# EAGLE board G_FY2015_Mez (EAGLE 6.5.0), part 1 of 2
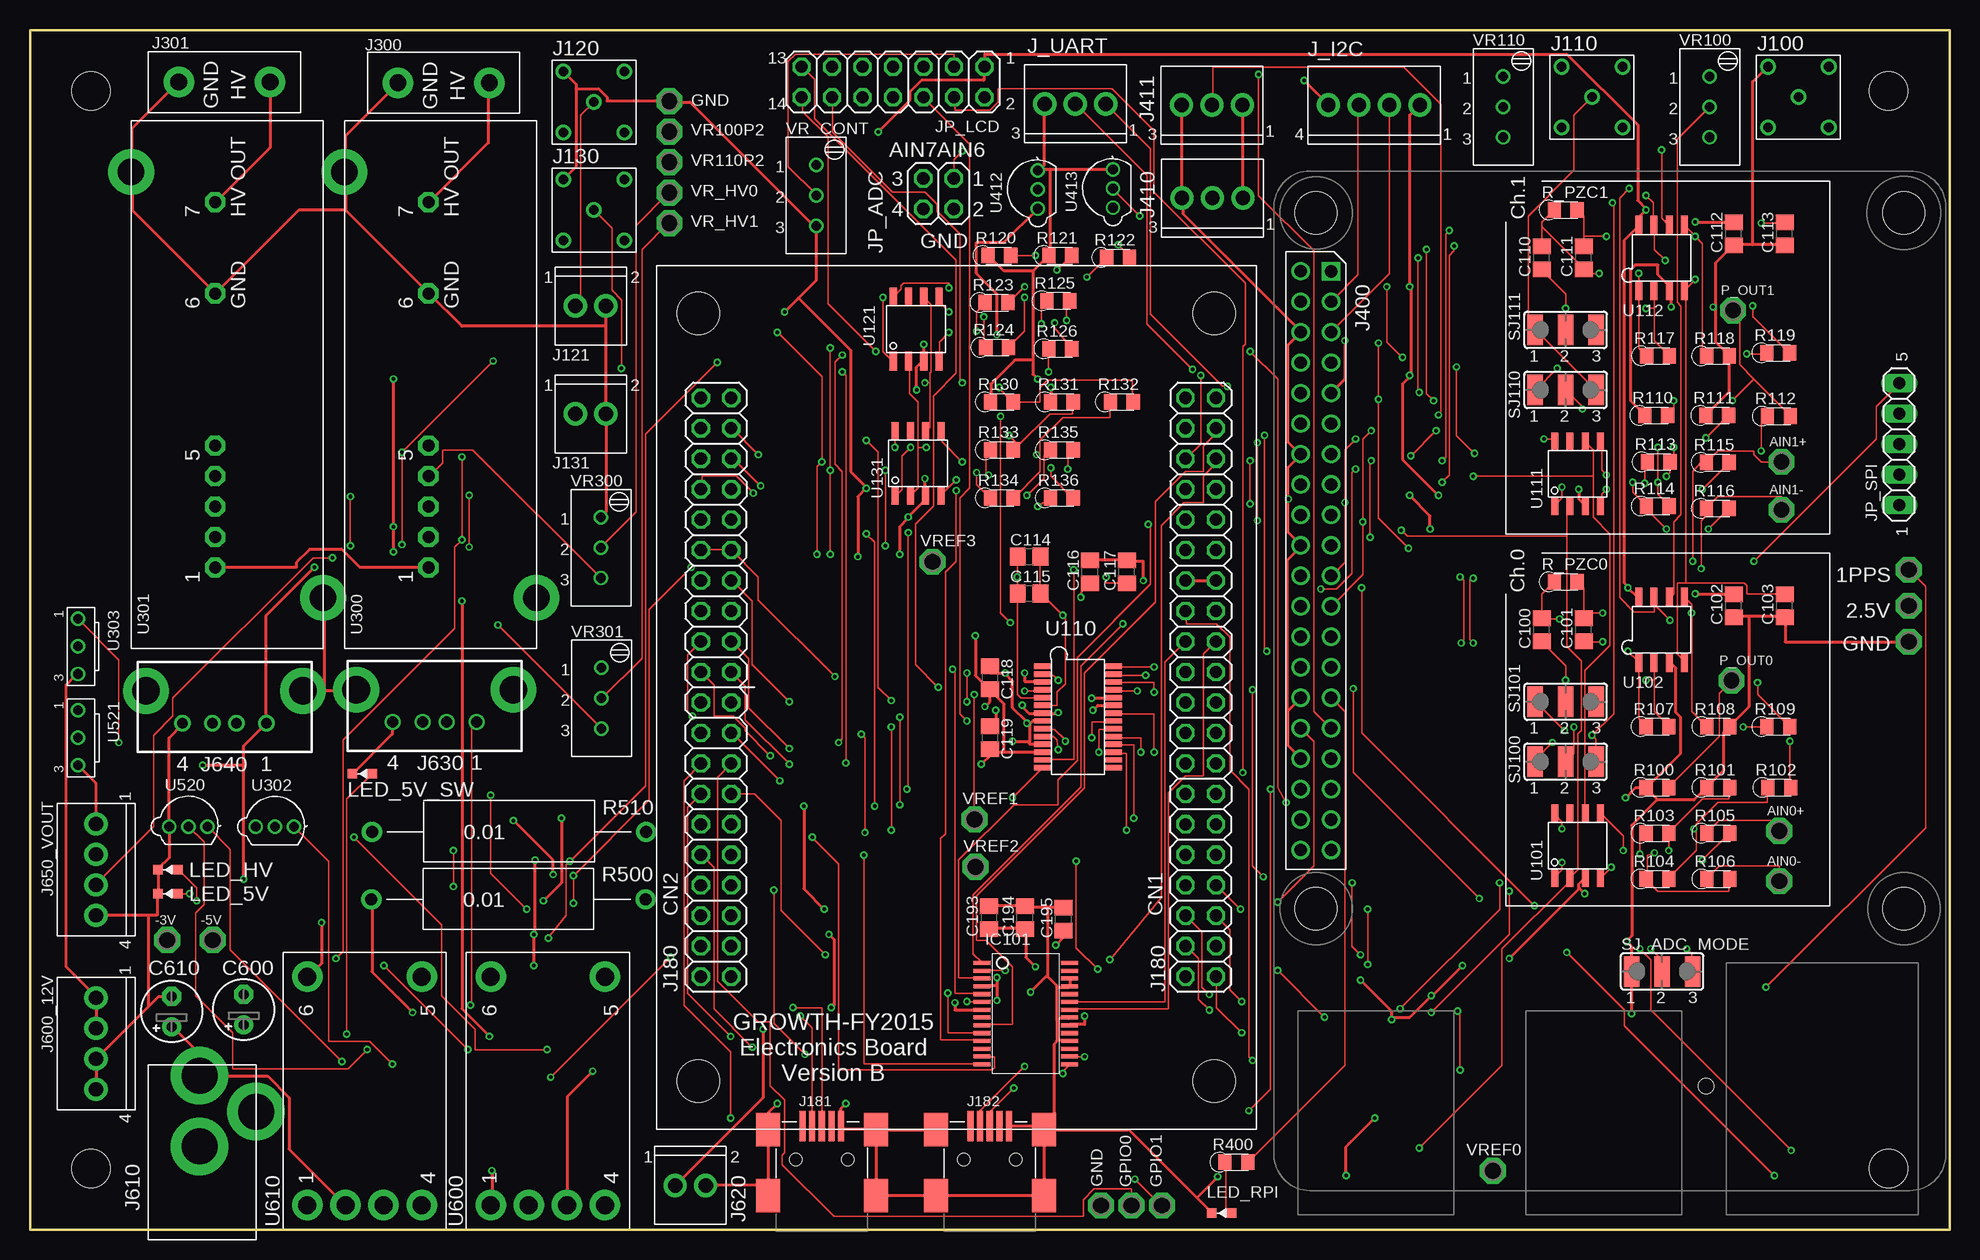
[diagram p5: board, top side]
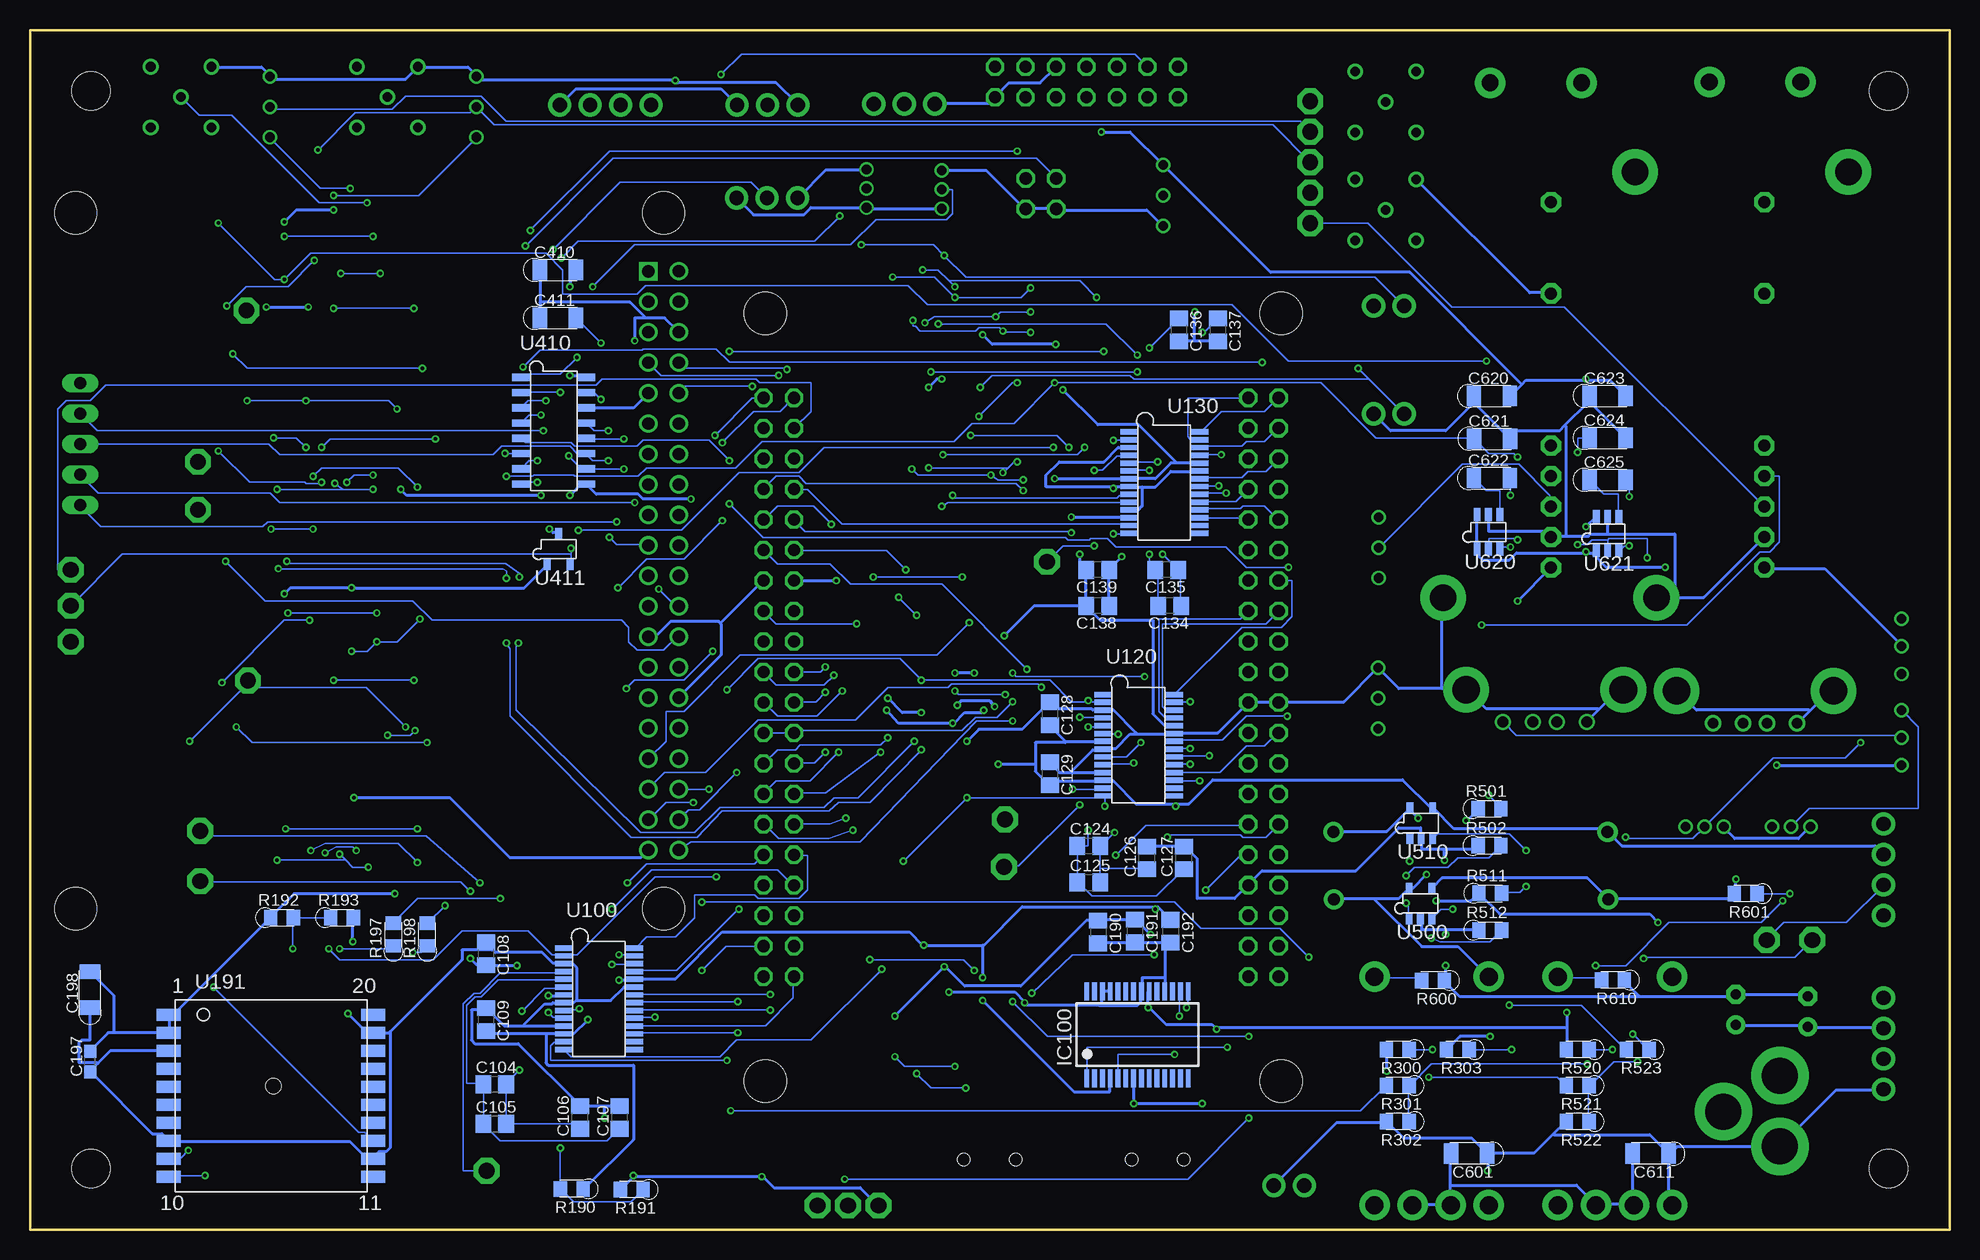
[diagram p6: board, bottom side, seen from below]

Size 160 x 100 mm. Coordinates in mm from the lower left corner, seen from the top.
Outline: 0,0 160,0 160,100 0,100 0,0
Copper layers (1+2*15+16): Top 0.018mm / dielectric 0.25mm / Route2 0.035mm / dielectric 1mm / Route15 0.035mm / dielectric 0.25mm / Bottom 0.018mm
Design rules "pban_5mil-l4": minimum track width 5mil, minimum drill 0.3mm, track to track 5mil, track to pad 0.229mm, pad to pad 5mil, via to via 5mil, smd to smd 5mil, copper to edge 0.5mm, drill to drill 0.5mm, minimum pad ring 0.15mm, minimum via ring 0.15mm, stop-mask expansion 4mil, vias tented up to drill 0.35mm, thermal gap 10mil
Net classes: 1 power: width 0.254 mm, clearance 0.178 mm
Holes 3.2 mm at 5.08,5.08 5.08,94.92 154.92,5.08 154.92,94.92
tRestrict: area 2,2 to 8,8; area 2,92 to 8,98; area 152,92 to 158,98; area 152,2 to 158,8
bRestrict: area 2,2 to 8,8; area 2,92 to 8,98; area 152,92 to 158,98; area 152,2 to 158,8

## Footprints (pad centres in the part's own frame; a part is rotated, then mirrored left to right if it is on the bottom)
P1-13 = drill 1.321 pad 2.159 octagon: TP 0,0
C0805 = smd 1.3 x 1.5: 1 -0.95,0; 2 0.95,0
C0603 = smd 1.1 x 1: 1 -0.85,0; 2 0.85,0
3216 = smd 1.2 x 1.7: 1 -1.5,0; 2 1.5,0
E2,5-5 = drill 0.813 pad 1.6: + -1.27,0 | drill 0.813 pad 1.6 octagon: - 1.27,0
SSOP28 = smd 0.4 x 1.5: 1 -4.225,-3.625; 2 -3.575,-3.625; 3 -2.925,-3.625; 4 -2.275,-3.625; 5 -1.625,-3.625; 6 -0.975,-3.625; 7 -0.325,-3.625; 8 0.325,-3.625; 9 0.975,-3.625; 10 1.625,-3.625; 11 2.275,-3.625; 12 2.925,-3.625; 13 3.575,-3.625; 14 4.225,-3.625; 15 4.225,3.625; 16 3.575,3.625; 17 2.925,3.625; 18 2.275,3.625; 19 1.625,3.625; 20 0.975,3.625; 21 0.325,3.625; 22 -0.325,3.625; 23 -0.975,3.625; 24 -1.625,3.625; 25 -2.275,3.625; 26 -2.925,3.625; 27 -3.575,3.625; 28 -4.225,3.625
SSOP28DB = smd 0.348 x 1.397: 1 -4.225,-3.656; 2 -3.575,-3.656; 3 -2.925,-3.656; 4 -2.275,-3.656; 5 -1.625,-3.656; 6 -0.975,-3.656; 7 -0.325,-3.656; 8 0.325,-3.656; 9 0.975,-3.656; 10 1.625,-3.656; 11 2.275,-3.656; 12 2.925,-3.656; 13 3.575,-3.656; 14 4.225,-3.656; 15 4.225,3.656; 16 3.575,3.656; 17 2.925,3.656; 18 2.275,3.656; 19 1.625,3.656; 20 0.975,3.656; 21 0.325,3.656; 22 -0.325,3.656; 23 -0.975,3.656; 24 -1.625,3.656; 25 -2.275,3.656; 26 -2.925,3.656; 27 -3.575,3.656; 28 -4.225,3.656
EPL.00.250.NTN = drill 0.8 pad 1.3: 1 0,0; S1 -2.54,2.54; S2 -2.54,-2.54; S3 2.54,-2.54; S4 2.54,2.54
IL-2P-S3EN2 = drill 1.2 pad 1.93: P$1 -2.54,0; P$2 0,0
TOKUDEN_SP6 = drill 1.016 octagon: 1 12.71,-46.65; 2 12.71,-44.11; 3 15.25,-46.65; 4 15.25,-44.11; 5 17.79,-46.65; 6 17.79,-44.11; 7 20.33,-46.65; 8 20.33,-44.11; 9 22.87,-46.65; 10 22.87,-44.11; 11 25.41,-46.65; 12 25.41,-44.11; 13 27.95,-46.65; 14 27.95,-44.11; 15 30.49,-46.65; 16 30.49,-44.11; 17 33.03,-46.65; 18 33.03,-44.11; 19 35.57,-46.65; 20 35.57,-44.11; 21 38.11,-46.65; 22 38.11,-44.11; 23 40.65,-46.65; 24 40.65,-44.11; 25 43.19,-46.65; 26 43.19,-44.11; 27 45.73,-46.65; 28 45.73,-44.11; 29 48.27,-46.65; 30 48.27,-44.11; 31 50.81,-46.65; 32 50.81,-44.11; 33 53.35,-46.65; 34 53.35,-44.11; 35 55.89,-46.65; 36 55.89,-44.11; 37 58.43,-46.65; 38 58.43,-44.11; 39 60.97,-46.65; 40 60.97,-44.11; 41 12.71,-6.24; 42 12.71,-3.7; 43 15.25,-6.24; 44 15.25,-3.7; 45 17.79,-6.24; 46 17.79,-3.7; 47 20.33,-6.24; 48 20.33,-3.7; 49 22.87,-6.24; 50 22.87,-3.7; 51 25.41,-6.24; 52 25.41,-3.7; 53 27.95,-6.24; 54 27.95,-3.7; 55 30.49,-6.24; 56 30.49,-3.7; 57 33.03,-6.24; 58 33.03,-3.7; 59 35.57,-6.24; 60 35.57,-3.7; 61 38.11,-6.24; 62 38.11,-3.7; 63 40.65,-6.24; 64 40.65,-3.7; 65 43.19,-6.24; 66 43.19,-3.7; 67 45.73,-6.24; 68 45.73,-3.7; 69 48.27,-6.24; 70 48.27,-3.7; 71 50.81,-6.24; 72 50.81,-3.7; 73 53.35,-6.24; 74 53.35,-3.7; 75 55.89,-6.24; 76 55.89,-3.7; 77 58.43,-6.24; 78 58.43,-3.7; 79 60.97,-6.24; 80 60.97,-3.7 | hole 3.5: 4,-3.5; 4,-46.5; 68,-46.5; 68,-3.5
MINIUSB5+4P-SMD-0.8-90D = smd 2.54 x 0.508: 1 0.381,-1.6; 2 0.381,-0.8; 3 0.381,0; 4 0.381,0.8; 5 0.381,1.6 | smd 2.794 x 2: P$1 6.175,4.5; P$2 6.175,-4.5; P$3 0.675,4.5; P$4 0.675,-4.5 | hole 1.016: 3.175,-2.159; 3.175,2.159
SHV_PIGTAIL_LAND = drill 1.4 pad 2.54: P$1 0,3.81; P$2 0,-3.81
RPI2_GPIO_HOLES = drill 1.016 square: P$1 -33.54,23.29 | drill 1.016: P$2 -33.553,25.832; P$3 -31.013,23.292; P$4 -31.013,25.832; P$5 -28.473,23.292; P$6 -28.473,25.832; P$7 -25.933,23.292; P$8 -25.933,25.832; P$9 -23.393,23.292; P$10 -23.393,25.832; P$11 -20.853,23.292; P$12 -20.853,25.832; P$13 -18.313,23.292; P$14 -18.313,25.832; P$15 -15.773,23.292; P$16 -15.773,25.832; P$17 -13.233,23.292; P$18 -13.233,25.832; P$19 -10.693,23.292; P$20 -10.693,25.832; P$21 -8.153,23.292; P$22 -8.153,25.832; P$23 -5.613,23.292; P$24 -5.613,25.832; P$25 -3.073,23.292; P$26 -3.073,25.832; P$27 -0.533,23.292; P$28 -0.533,25.832; P$29 2.007,23.292; P$30 2.007,25.832; P$31 4.547,23.292; P$32 4.547,25.832; P$33 7.087,23.292; P$34 7.087,25.832; P$35 9.627,23.292; P$36 9.627,25.832; P$37 12.167,23.292; P$38 12.167,25.832; P$39 14.707,23.292; P$40 14.707,25.832 | hole 3.5: -38.41,-24.44; 19.59,-24.44; -38.41,24.56; 19.59,24.56
IL-3P-S3EN2 = drill 1.2 pad 1.93: P$1 -2.54,0; P$2 0,0; P$3 2.54,0
IL-4P-S3EN2 = drill 1.2 pad 1.93: P$1 -3.81,0; P$2 -1.27,0; P$3 1.27,0; P$4 3.81,0
PJ-102A = drill 3 pad 4.8: RING 0.1,-3.39; RING_SW -4.6,-6.29; TIP 0.1,-9.29
LUMBERG_2410-01 = drill 0.9: D+ -1,0; D- 1,0; GND -3.5,0; VBUS 3.5,0 | drill 2.3 pad 3.81: GND1 -6.55,2.7; GND2 6.55,2.7
2X02 = drill 1.016 octagon: 1 -1.27,-1.27; 2 -1.27,1.27; 3 1.27,-1.27; 4 1.27,1.27
LCD16X2 = drill 1.016 octagon: 1 -7.62,-1.27; 2 -7.62,1.27; 3 -5.08,-1.27; 4 -5.08,1.27; 5 -2.54,-1.27; 6 -2.54,1.27; 7 0,-1.27; 8 0,1.27; 9 2.54,-1.27; 10 2.54,1.27; 11 5.08,-1.27; 12 5.08,1.27; 13 7.62,-1.27; 14 7.62,1.27
1X05 = drill 1.016 long: 1 -5.08,0; 2 -2.54,0; 3 0,0; 4 2.54,0; 5 5.08,0
LED_1608 = smd 0.8 x 0.8: P$1 0,0.825; P$2 0,-0.825
2012 = smd 1.1 x 1.3: 1 -0.95,0; 2 0.95,0
R_LVR03 = drill 1 pad 1.676: P$1 -11.43,0; P$2 11.43,0
SJ_2W = smd 1.27 x 2.54: 1 -2.54,0; 2 0,0; 3 2.54,0
TSSOP-28(4.4MM)(0.65MM)_LONGPAD = smd 0.45 x 1.4: 1 -4.225,-2.975; 2 -3.575,-2.975; 3 -2.925,-2.975; 4 -2.275,-2.975; 5 -1.625,-2.975; 6 -0.975,-2.975; 7 -0.325,-2.975; 8 0.325,-2.975; 9 0.975,-2.975; 10 1.625,-2.975; 11 2.275,-2.975; 12 2.925,-2.975; 13 3.575,-2.975; 14 4.225,-2.975; 15 4.225,2.975; 16 3.575,2.975; 17 2.925,2.975; 18 2.275,2.975; 19 1.625,2.975; 20 0.975,2.975; 21 0.325,2.975; 22 -0.325,2.975; 23 -0.975,2.975; 24 -1.625,2.975; 25 -2.275,2.975; 26 -2.925,2.975; 27 -3.575,2.975; 28 -4.225,2.975
SOIC-8(150MIL)(1.27MM) = smd 0.6 x 1.55: 1 -1.905,-2.67; 2 -0.635,-2.67; 3 0.635,-2.67; 4 1.905,-2.67; 5 1.905,2.67; 6 0.635,2.67; 7 -0.635,2.67; 8 -1.905,2.67
SOP8 = smd 0.6 x 1.62: 1 -1.905,-2.694; 2 -0.635,-2.694; 3 0.635,-2.694; 4 1.905,-2.694; 5 1.905,2.694; 6 0.635,2.694; 7 -0.635,2.694; 8 -1.905,2.694
GPS_FGPMMOPA6H = smd 2 x 1: P$1 -8.508,6.75; P$2 -8.508,5.25; P$3 -8.508,3.75; P$4 -8.508,2.25; P$5 -8.508,0.75; P$6 -8.508,-0.75; P$7 -8.508,-2.25; P$8 -8.508,-3.75; P$9 -8.508,-5.25; P$10 -8.508,-6.75; P$11 8.508,-6.75; P$12 8.508,-5.25; P$13 8.508,-3.75; P$14 8.508,-2.25; P$15 8.508,-0.75; P$16 8.508,0.75; P$17 8.508,2.25; P$18 8.508,3.75; P$19 8.508,5.25; P$20 8.508,6.75 | hole 1.3: 0.2,0.8
OPTON_PA = drill 1 pad 1.676 octagon: P$1 -15.24,0; P$2 -12.7,0; P$3 -10.16,0; P$4 -7.62,0; P$5 -5.08,0; P$6 7.62,0; P$7 15.24,0 | drill 2.2 pad 3.81: P$8 17.75,7; P$9 -17.75,-9
TO-92-R2.5C = drill 0.8: 1 -1.6,0; 2 0,0; 3 1.6,0
2-7J2B = drill 0.8: P$1 -2.3,0; P$2 0,0; P$3 2.3,0
SOIC-16(150MIL)(1.27MM) = smd 0.6 x 1.55: 1 -4.445,-2.68; 2 -3.175,-2.68; 3 -1.905,-2.68; 4 -0.635,-2.68; 5 0.635,-2.68; 6 1.905,-2.68; 7 3.175,-2.68; 8 4.445,-2.68; 9 4.445,2.66; 10 3.175,2.66; 11 1.905,2.66; 12 0.635,2.66; 13 -0.635,2.66; 14 -1.905,2.66; 15 -3.175,2.66; 16 -4.445,2.66
TSOT-23-3 = smd 0.57 x 0.95: 1 -0.95,-1.25; 2 0.95,-1.25; 3 0,1.29
TSOT-5 = smd 0.57 x 0.95: 1 -0.95,-1.25; 2 0,-1.25; 3 0.95,-1.25; 4 0.95,1.25; 5 -0.95,1.25
PHT12050 = drill 1.5 pad 2.54: P$1 2.032,-2.032; P$2 2.032,-5.207; P$3 2.032,-8.382; P$4 2.032,-11.557; P$5 21.082,-11.557; P$6 21.082,-2.032
SOT-23 = smd 0.57 x 1.1: 1 -0.95,-1.4; 2 0,-1.4; 3 0.95,-1.4; 4 0.95,1.45; 5 0,1.45; 6 -0.95,1.45
ADJRP3-9.70XW5.0X9.80MM = drill 0.8: 1 0,2.54; 2 0,0; 3 0,-2.54

## Placement (x,y rotation side)
1PPS  TPPAD1-13  [P1-13]  156.6,55 180 top
2.5V  TPPAD1-13  [P1-13]  156.6,52 180 top
-3V  TPPAD1-13  [P1-13]  11.43,24.13 0 top
-5V  TPPAD1-13  [P1-13]  15.24,24.13 0 top
AIN0+  TPPAD1-13  [P1-13]  145.81,33.23 0 top
AIN0-  TPPAD1-13  [P1-13]  145.81,29.04 0 top
AIN1+  TPPAD1-13  [P1-13]  146,64 0 top
AIN1-  TPPAD1-13  [P1-13]  146,60 0 top
C100  100p  [C0805]  126,50 90 top
C101  200p  [C0805]  129.5,50 90 top
C102  0.033u  [C0805]  142,52 90 top
C103  0.033u  [C0805]  146.25,52 90 top
C104  0.1u  [C0805]  121.26,12.12 0 bottom
C105  10u  [C0805]  121.26,8.81 0 bottom
C106  0.1u  [C0805]  114.15,9.35 90 bottom
C107  0.1u  [C0805]  110.84,9.35 90 bottom
C108  0.1u  [C0805]  122,23 270 bottom
C109  10u  [C0805]  122,17.5 270 bottom
C110  100p  [C0805]  126,81 90 top
C111  200p  [C0805]  129.5,81 90 top
C112  0.033u  [C0805]  142,83 90 top
C113  0.033u  [C0805]  146.25,83 90 top
C114  0.1u  [C0805]  83.28,56.1 0 top
C115  10u  [C0805]  83.28,53.04 0 top
C116  0.1u  [C0805]  88.36,54.83 90 top
C117  0.1u  [C0805]  91.42,54.83 90 top
C118  0.1u  [C0805]  80,46 270 top
C119  10u  [C0805]  80,41 270 top
C124  0.1u  [C0805]  71.75,32 0 bottom
C125  10u  [C0805]  71.75,28.94 0 bottom
C126  0.1u  [C0805]  66.89,30.98 90 bottom
C127  0.1u  [C0805]  63.83,30.98 90 bottom
C128  0.1u  [C0805]  75,43 270 bottom
C129  10u  [C0805]  75,38 270 bottom
C134  0.1u  [C0805]  65,52 180 bottom
C135  10u  [C0805]  65.25,55 180 bottom
C136  0.1u  [C0805]  64.25,75 270 bottom
C137  0.1u  [C0805]  61,75 270 bottom
C138  0.1u  [C0805]  71,52 180 bottom
C139  10u  [C0805]  71,55 180 bottom
C190  0.1u  [C0805]  70.96,24.8 270 bottom
C191  4.7u  [C0805]  67.92,24.88 270 bottom
C192  0.1u  [C0805]  64.93,24.86 270 bottom
C193  0.1u  [C0805]  79.95,26 90 top
C194  4.7u  [C0805]  82.94,26 90 top
C195  0.1u  [C0805]  86.15,25.88 90 top
C197  0.01u  [C0603]  155,14 90 bottom
C198  10u  [3216]  155,20 90 bottom
C410  1u  [3216]  116,80 0 bottom
C411  10u  [3216]  116,76 0 bottom
C600  100u  [E2,5-5]  17.81,18.33 90 top
C601  10u  [3216]  40.04,6.32 180 bottom
C610  100u  [E2,5-5]  11.81,18.18 90 top
C611  10u  [3216]  24.93,6.32 180 bottom
C620  10u  [3216]  38.15,69.49 0 bottom
C621  10u  [3216]  38.11,65.93 0 bottom
C622  1u  [3216]  38.15,62.65 0 bottom
C623  10u  [3216]  28.5,69.5 0 bottom
C624  10u  [3216]  28.5,66 0 bottom
C625  1u  [3216]  28.5,62.5 0 bottom
GND  TPPAD1-13  [P1-13]  156.6,49 180 top
GPIO0  TPPAD1-13  [P1-13]  91.81,2 90 top
GPIO1  TPPAD1-13  [P1-13]  94.35,2 90 top
IC100  FT232RL  [SSOP28]  67.69,16.24 0 bottom
IC101  FT245RL  [SSOP28DB]  83,18 270 top
J100  EPL.00.250.NTN  [EPL.00.250.NTN]  147.4,94.4 0 top
J110  EPL.00.250.NTN  [EPL.00.250.NTN]  130.2,94.4 0 top
J120  EPL.00.250.NTN  [EPL.00.250.NTN]  47,94 0 top
J121  IL-2P-S3EN2  [IL-2P-S3EN2]  48,77 0 top
J130  EPL.00.250.NTN  [EPL.00.250.NTN]  47,85 0 top
J131  IL-2P-S3EN2  [IL-2P-S3EN2]  48,68 0 top
J180  TOKUDEN_SP6  [TOKUDEN_SP6]  52.21,8.37 90 top
J181  USB Mini-B Connector  [MINIUSB5+4P-SMD-0.8-90D]  66,9 270 top
J182  USB Mini-B Connector  [MINIUSB5+4P-SMD-0.8-90D]  80,9 270 top
J300  SHV_PIGTAIL_LAND  [SHV_PIGTAIL_LAND]  34.48,95.6 270 top
J301  SHV_PIGTAIL_LAND  [SHV_PIGTAIL_LAND]  16.21,95.66 270 top
J400  RPI2_GPIO_HOLES  [RPI2_GPIO_HOLES]  131.75,46.34 270 bottom
J410  IL-3P-S3EN2  [IL-3P-S3EN2]  98.56,86 180 top
J411  IL-3P-S3EN2  [IL-3P-S3EN2]  98.52,93.75 180 top
J600_12V  IL-4P-S3EN2  [IL-4P-S3EN2]  5.5,15.5 270 top
J610  2.1MMJACKTHM  [PJ-102A]  14.24,3.54 180 top
J620  IL-2P-S3EN2  [IL-2P-S3EN2]  56.32,3.67 0 top
J630  USB_TYPEA_LUMBERG_2410_01  [LUMBERG_2410-01]  33.74,42.31 0 top
J640  USB_TYPEA_LUMBERG_2410_01  [LUMBERG_2410-01]  16.21,42.2 0 top
J650_VOUT  IL-4P-S3EN2  [IL-4P-S3EN2]  5.5,30 270 top
J_I2C  IL-4P-S3EN2  [IL-4P-S3EN2]  112.04,93.75 180 top
J_UART  IL-3P-S3EN2  [IL-3P-S3EN2]  87.13,93.83 180 top
JP_ADC  [2X02]  75.73,86.35 180 top
JP_LCD  LCD16X2  [LCD16X2]  71.94,95.66 180 top
JP_SPI  [1X05]  155.81,65.47 90 top
LED_5V  SML-311WTT86  [LED_1608]  11.5,28 270 top
LED_5V_SW  SML-311WTT86  [LED_1608]  27.7,38 270 top
LED_HV  SML-311WTT86  [LED_1608]  11.5,30 270 top
LED_RPI  SML-311WTT86  [LED_1608]  99.34,1.36 270 top
P_OUT0  TPPAD1-13  [P1-13]  141.83,45.76 0 top
P_OUT1  TPPAD1-13  [P1-13]  141.96,76.62 0 top
R100  51  [2012]  135.65,36.85 0 top
R101  510  [2012]  140.73,36.85 0 top
R102  510  [2012]  145.81,36.85 0 top
R103  510  [2012]  135.65,33.04 0 top
R104  510  [2012]  135.65,29.23 0 top
R105  51  [2012]  140.73,33.04 0 top
R106  51  [2012]  140.73,29.23 0 top
R107  100k  [2012]  135.65,41.93 0 top
R108  10k  [2012]  140.73,41.93 0 top
R109  51  [2012]  145.73,41.93 0 top
R110  51  [2012]  135.55,67.87 0 top
R111  510  [2012]  140.63,67.87 0 top
R112  510  [2012]  145.77,67.81 0 top
R113  510  [2012]  135.75,64 0 top
R114  510  [2012]  135.67,60.31 0 top
R115  51  [2012]  140.67,63.95 0 top
R116  51  [2012]  140.67,60.12 0 top
R117  100k  [2012]  135.7,72.84 0 top
R118  10k  [2012]  140.7,72.83 0 top
R119  51  [2012]  145.72,73.09 0 top
R120  51  [2012]  80.8,81.2 0 top
R121  510  [2012]  85.88,81.2 0 top
R122  510  [2012]  90.7,81.04 0 top
R123  510  [2012]  80.56,77.28 0 top
R124  510  [2012]  80.62,73.54 0 top
R125  51  [2012]  85.71,77.43 0 top
R126  51  [2012]  85.88,73.43 0 top
R130  51  [2012]  81,69 0 top
R131  510  [2012]  86,69 0 top
R132  510  [2012]  91,69 0 top
R133  510  [2012]  81,65 0 top
R134  510  [2012]  81,61 0 top
R135  51  [2012]  86,65 0 top
R136  51  [2012]  86,61 0 top
R190  3k  [2012]  114.84,3.39 180 bottom
R191  1k  [2012]  109.84,3.33 180 bottom
R192  2k  [2012]  139,26 0 bottom
R193  1k  [2012]  134,26 0 bottom
R197  330  [2012]  129.7,24.59 90 bottom
R198  330  [2012]  126.89,24.59 90 bottom
R300  47k  [2012]  46,15 180 bottom
R301  4.7k  [2012]  46,12 180 bottom
R302  4.7k  [2012]  46,9 180 bottom
R303  4.7k  [2012]  41,15 180 bottom
R400  680  [2012]  100.56,5.62 0 top
R500  0.01  [R_LVR03]  39.88,27.51 0 top
R501  100  [2012]  38.35,35.08 0 bottom
R502  10k  [2012]  38.35,32.01 0 bottom
R510  0.01  [R_LVR03]  39.93,33.15 0 top
R511  100  [2012]  38.29,28.03 0 bottom
R512  10k  [2012]  38.29,24.96 0 bottom
R520  47k  [2012]  31,15 180 bottom
R521  4.7k  [2012]  31,12 180 bottom
R522  4.7k  [2012]  31,9 180 bottom
R523  1.5k  [2012]  26,15 180 bottom
R600  270  [2012]  43.05,20.76 180 bottom
R601  1.5k  [2012]  17,28 180 bottom
R610  2k  [2012]  28.05,20.79 180 bottom
R_PZC0  56k  [2012]  128,54 0 top
R_PZC1  56k  [2012]  128,85 0 top
SJ100  [SJ_2W]  128,39 0 top
SJ101  [SJ_2W]  128,44 0 top
SJ110  [SJ_2W]  128,70 0 top
SJ111  [SJ_2W]  128,75 0 top
SJ_ADC_MODE  [SJ_2W]  136.04,21.52 0 top
TP_GND  TPPAD1-13  [P1-13]  53.29,94.06 0 top
TP_GND2  TPPAD1-13  [P1-13]  89.27,2 90 top
U100  AD9215LONG_PAD  [TSSOP-28(4.4MM)(0.65MM)_LONGPAD]  112.57,19.24 270 bottom
U101  AD8138  [SOIC-8(150MIL)(1.27MM)]  129,32 0 top
U102  LM6172  [SOP8]  136,50 0 top
U110  AD9215LONG_PAD  [TSSOP-28(4.4MM)(0.65MM)_LONGPAD]  87.36,42.72 270 top
U111  AD8138  [SOIC-8(150MIL)(1.27MM)]  129,63 0 top
U112  LM6172  [SOP8]  136,81 0 top
U120  AD9215LONG_PAD  [TSSOP-28(4.4MM)(0.65MM)_LONGPAD]  67.58,40.37 270 bottom
U121  AD8138  [SOIC-8(150MIL)(1.27MM)]  73.86,75.07 0 top
U130  AD9215LONG_PAD  [TSSOP-28(4.4MM)(0.65MM)_LONGPAD]  65.45,62.26 270 bottom
U131  AD8138  [SOIC-8(150MIL)(1.27MM)]  74.02,63.87 0 top
U191  GPS_FGPMMOPA6H  [GPS_FGPMMOPA6H]  139.91,11.16 0 bottom
U300  OPTON_1PA_12  [OPTON_PA]  33.21,70.42 90 top
U301  OPTON_1PA_12  [OPTON_PA]  15.43,70.42 90 top
U302  2SC1815  [TO-92-R2.5C]  20.41,33.57 0 top
U303  2SJ681  [2-7J2B]  4,48.62 270 top
U410  MCP3208-CI/SL  [SOIC-16(150MIL)(1.27MM)]  116.34,66.6 270 bottom
U411  MCP1525TSOT-23-3  [TSOT-23-3]  115.94,56.72 0 bottom
U412  LM60  [TO-92-R2.5C]  84.01,86.7 90 top
U413  LM60  [TO-92-R2.5C]  90.27,86.79 90 top
U500  LT6106  [TSOT-5]  44.1,27.18 0 bottom
U510  LT6106  [TSOT-5]  44.04,33.88 0 bottom
U520  2SC1815  [TO-92-R2.5C]  13.2,33.6 0 top
U521  2SJ681  [2-7J2B]  4,41 270 top
U600  PHT12050WAH  [PHT12050]  36.37,0 90 top
U610  PHT12050WAH  [PHT12050]  21.09,0 90 top
U620  LTC1983ES6-3  [SOT-23]  38.43,58.15 0 bottom
U621  LTC1983ES6-5  [SOT-23]  28.5,58 0 bottom
VR100  5k  [ADJRP3-9.70XW5.0X9.80MM]  140,93.6 0 top
VR100P2  TPPAD1-13  [P1-13]  53.29,91.52 0 top
VR110  5k  [ADJRP3-9.70XW5.0X9.80MM]  122.8,93.6 0 top
VR110P2  TPPAD1-13  [P1-13]  53.29,88.98 0 top
VR300  5k  [ADJRP3-9.70XW5.0X9.80MM]  47.59,56.85 0 top
VR301  5k  [ADJRP3-9.70XW5.0X9.80MM]  47.64,44.28 0 top
VR_CONT  5k  [ADJRP3-9.70XW5.0X9.80MM]  65.54,86.22 0 top
VR_HV0  TPPAD1-13  [P1-13]  53.29,86.44 0 top
VR_HV1  TPPAD1-13  [P1-13]  53.29,83.9 0 top
VREF0  TPPAD1-13  [P1-13]  121.93,4.9 0 top
VREF1  TPPAD1-13  [P1-13]  78.74,34.18 0 top
VREF2  TPPAD1-13  [P1-13]  78.81,30.22 0 top
VREF3  TPPAD1-13  [P1-13]  75.22,55.67 0 top